# Altium project 电源板.PrjPCB
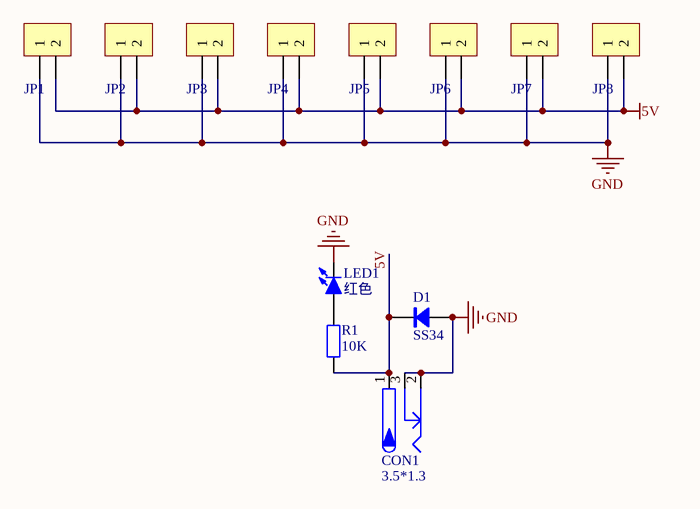
[diagram p0: 电源板.SchDoc]
1 sheet, 12 parts. Net scope: global (net labels, ports and power ports of the same name join across sheets).
Board file: 电源板.PcbDoc

## Sheet 电源板.SchDoc
size A4

### Parts
CON1  3.5*1.3  [DC-005]
D1  SS34  [SMA]
JP1  HDR-1X2  [HT3.96-WI-2P]  (value not drawn)
JP2  HDR-1X2  [HT3.96-WI-2P]  (value not drawn)
JP3  HDR-1X2  [HT3.96-WI-2P]  (value not drawn)
JP4  HDR-1X2  [HT3.96-WI-2P]  (value not drawn)
JP5  HDR-1X2  [HT3.96-WI-2P]  (value not drawn)
JP6  HDR-1X2  [HT3.96-WI-2P]  (value not drawn)
JP7  HDR-1X2  [HT3.96-WI-2P]  (value not drawn)
JP8  HDR-1X2  [HT3.96-WI-2P]  (value not drawn)
LED1  红色  [LED 0805R]
R1  10K  [R 0805_L]

### Nets
5V: CON1.1 D1.2(K) JP1.2 JP2.2 JP3.2 JP4.2 JP5.2 JP6.2 JP7.2 JP8.2 R1.1
GND: CON1.2 CON1.3 D1.1(A) JP1.1 JP2.1 JP3.1 JP4.1 JP5.1 JP6.1 JP7.1 JP8.1 LED1.2(K)
NetLED1_1: LED1.1(A) R1.2

### Library data of the parts
CON1 = P-DC: 低压电源接口; BOM名称: DC电源接口; 版权归属: 源创客; 学习资源: www.ooocke.com
D1 = SS54: 肖特基二极管; 版权归属: 源创客; 属性: 40V/3A; BOM名称: 肖特基二极管; 学习资源: www.ooocke.com
JP1-JP8 = Header 2: 2P接插件; 版权归属: 封装库来自淘宝卖家 ID：黄晶宝石; BOM名称: 2P接插件; 学习资源: https://shop463601444.taobao.com
LED1 = LED-SMD: 贴片LED; 版权归属: 封装库来自淘宝 ID：黄晶宝石; BOM名称: 贴片LED; 学习资源: https://shop463601444.taobao.com
R1 = R: 贴片电阻; 版权归属: 来自淘宝 ID：黄晶宝石; 封装库来自淘宝卖家 ID：黄晶宝石: 其他店铺购入均为盗版，不享受售后技术支持服务，请立即申请退款; BOM名称: 贴片电阻; 联系售后: https://shop463601444.taobao.com